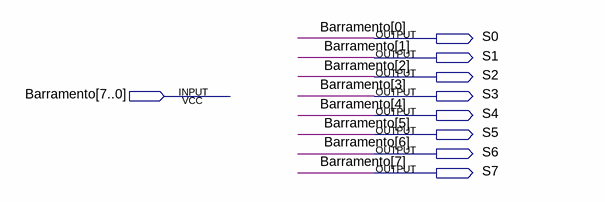
[diagram p0: schematic sheet]
// Quartus schematic tap8.bdf as structural Verilog: 0 symbols, 9 pins
module tap8 (
  input  [7:0] Barramento,
  output S0,
  output S1,
  output S2,
  output S3,
  output S4,
  output S5,
  output S6,
  output S7
);


  assign S0 = Barramento[0];
  assign S1 = Barramento[1];
  assign S2 = Barramento[2];
  assign S3 = Barramento[3];
  assign S4 = Barramento[4];
  assign S5 = Barramento[5];
  assign S6 = Barramento[6];
  assign S7 = Barramento[7];
endmodule
